# EAGLE design MEchaduino_03 (EAGLE 9.0.0)
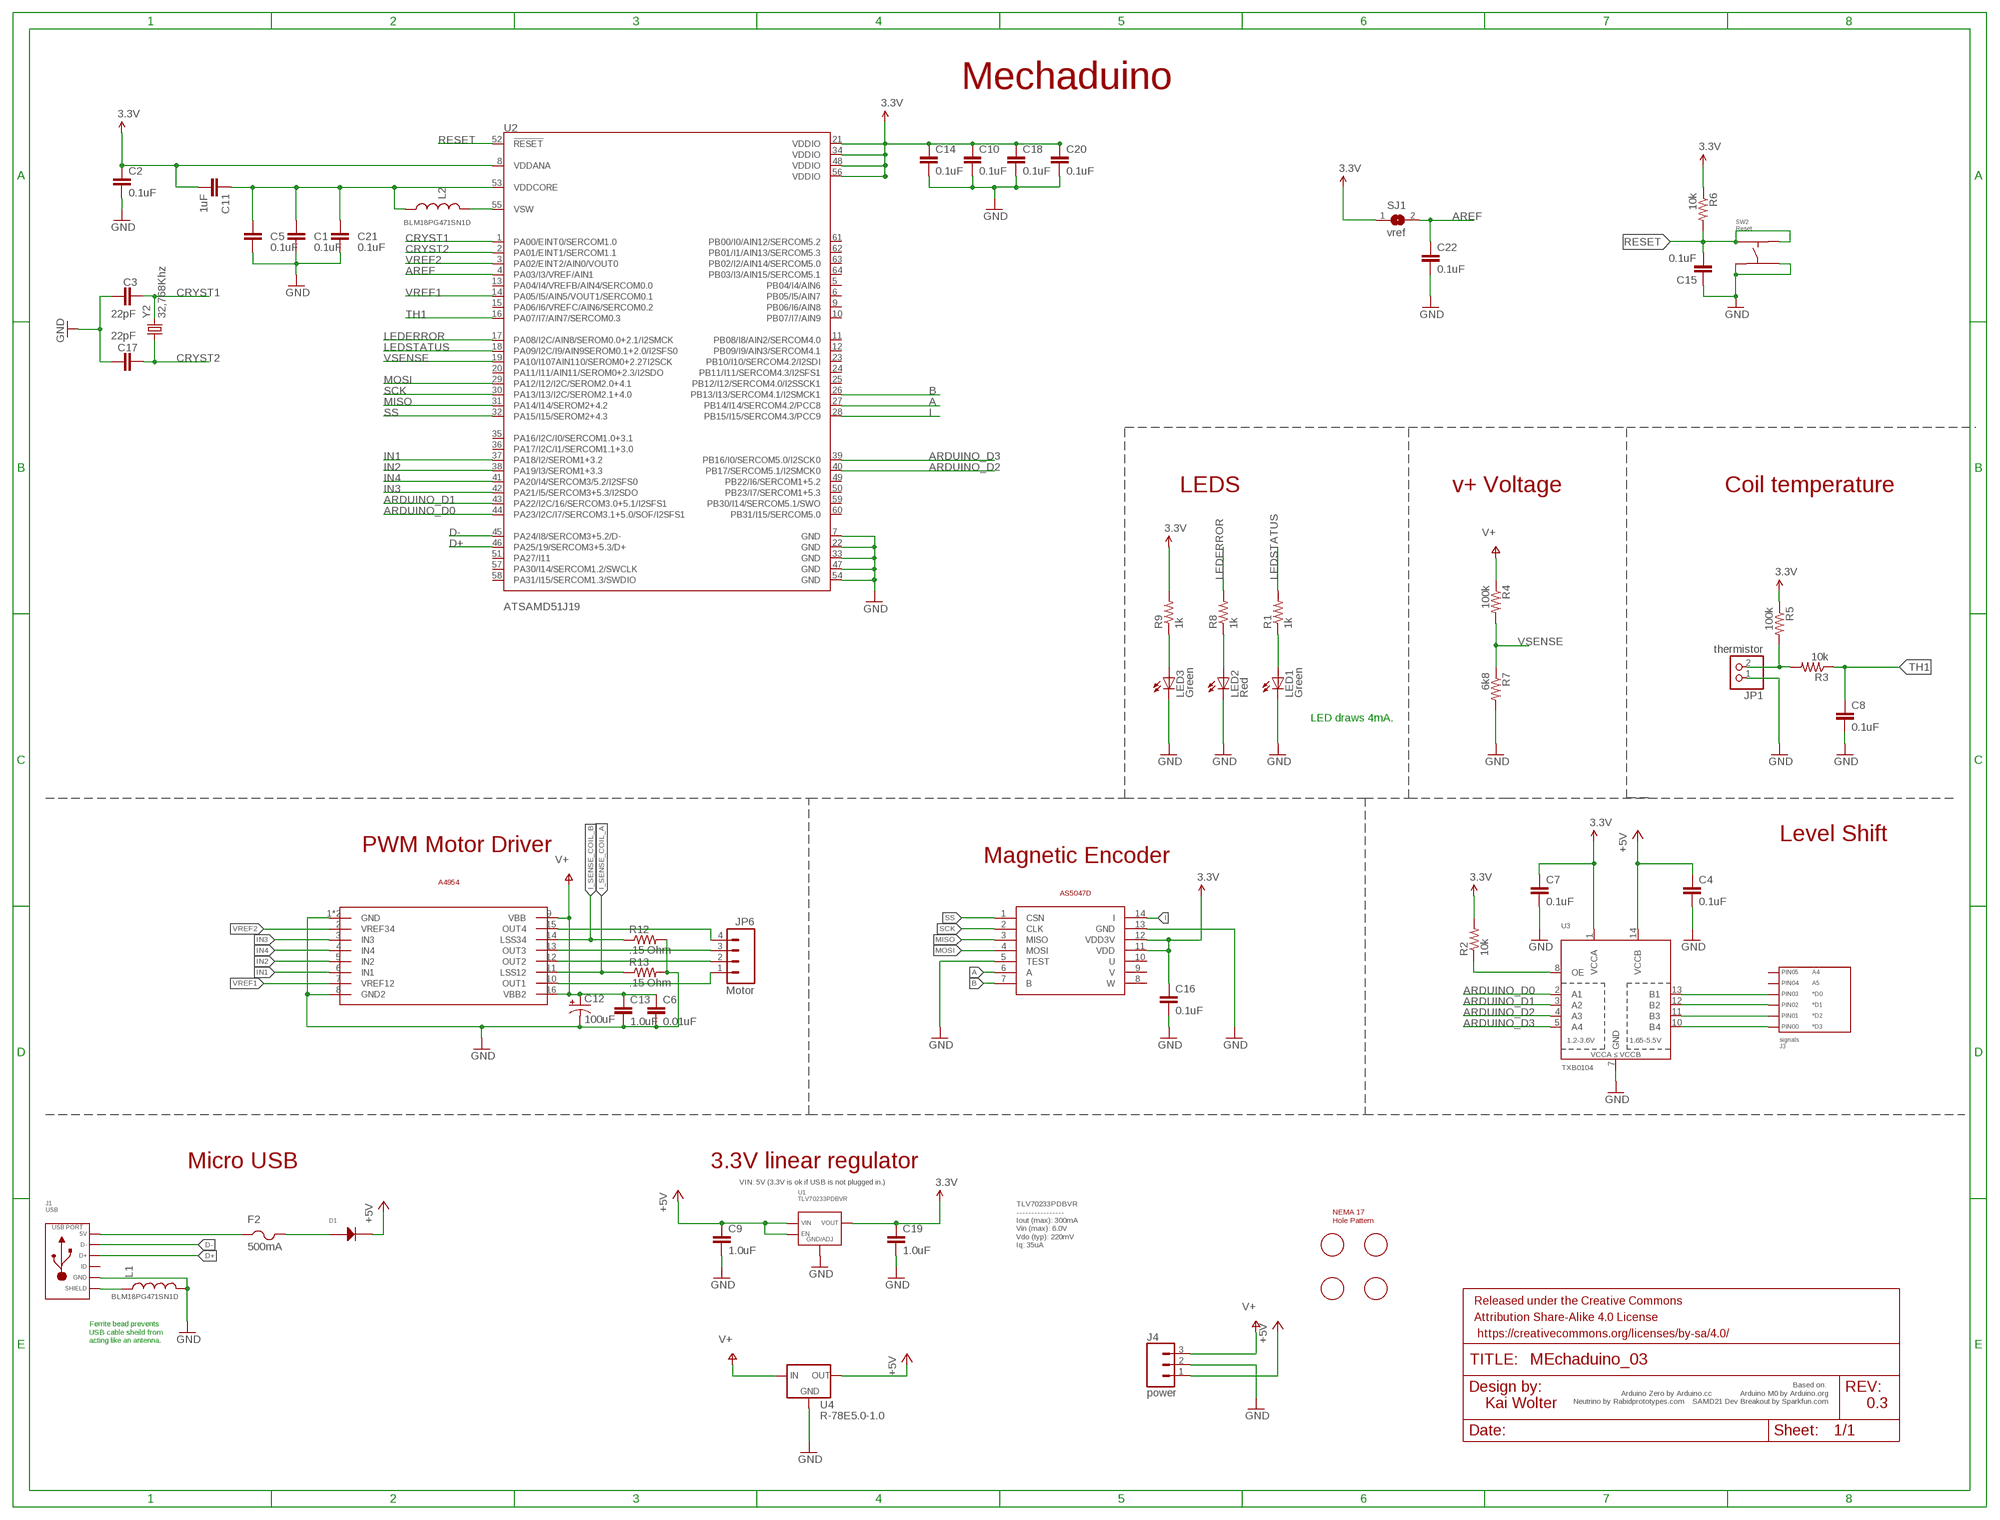
[diagram p0: schematic, sheet 1]

## Parts
C1  0.1uF  CAP0402  [0402-CAP]
C2  0.1uF  CAP0402  [0402-CAP]
C3  22pF  CAP0603  [0603-CAP]
C4  0.1uF  CAP0402  [0402-CAP]
C5  0.1uF  CAP0402  [0402-CAP]
C6  0.01uF  CAP0603  [0603-CAP]
C7  0.1uF  CAP0402  [0402-CAP]
C8  0.1uF  CAP0402  [0402-CAP]
C9  1.0uF  CAP0402  [0402-CAP]
C10  0.1uF  CAP0402  [0402-CAP]
C11  1uF  CAP0402  [0402-CAP]
C12  100uF  CAP_POLD  [PANASONIC_D]
C13  1.0uF  CAP0603  [0603-CAP]
C14  0.1uF  CAP0402  [0402-CAP]
C15  0.1uF  CAP0402  [0402-CAP]
C16  0.1uF  CAP0402  [0402-CAP]
C17  22pF  CAP0603  [0603-CAP]
C18  0.1uF  CAP0402  [0402-CAP]
C19  1.0uF  CAP0402  [0402-CAP]
C20  0.1uF  CAP0402  [0402-CAP]
C21  0.1uF  CAP0402  [0402-CAP]
C22  0.1uF  CAP0402  [0402-CAP]
D1  DIODE_SOD-123  [SOD-123]
F2  500mA  PTCFUSE-1206  [R1206]
FRAME1  FRAME-LEDGER  [CREATIVE_COMMONS]
J1  USB  USB_MICRO_RIGHT  [MICROUSB-RIGHT]
J3  signals  HEADER_01X06_PTH_2.54MM  [PTH_2.54MM_01X06]
J4  power  CONN_03  [1X03]
JP1  thermistor  PINHD-1X2  [1X02]
JP6  Motor  M04PTH  [1X04]
L1  BLM18PG471SN1D  INDUCTOR0603-TDK  [0603-TDK]
L2  BLM18PG471SN1D  INDUCTOR0603-TDK  [0603-TDK]
LED1  Green  0044_KPT-2012YC  [CHIPLED_0805]
LED2  Red  0044_KPT-2012YC  [CHIPLED_0805]
LED3  Green  0044_KPT-2012YC  [CHIPLED_0805]
R1  1k  R-US_R0402  [R0402]
R2  10k  R-US_R0402  [R0402]
R3  10k  R-US_R0402  [R0402]
R4  100k  R-US_R0402  [R0402]
R5  100k  R-US_R0402  [R0402]
R6  10k  R-US_R0402  [R0402]
R7  6k8  R-US_R0402  [R0402]
R8  1k  R-US_R0402  [R0402]
R9  1k  R-US_R0402  [R0402]
R12  .15 Ohm  R-US_R1206  [R1206]
R13  .15 Ohm  R-US_R1206  [R1206]
SJ1  vref  SJ  [SJ]
SW2  Reset  TACT_4.2MM  [TACT4.2MM]
U1  TLV70233PDBVR  [SOT-23-5]
U2  ATSAMD51J19  [TQFP64]
U3  TXB0104  TXB0104PWR  [TSSOP14]
U4  R-78E5.0-1.0  [DC-DC_CONVERTER_78XX]
U$1  AVAGO_DRIVERTHERM  [TSSOP16_THERM]
U$2  NEMA17_HOLE_PATTERNNEW  [NEMA17_HOLE_PATTERN_2]
U$4  AS5047D  [TSSOP14]
Y2  32,768Khz  CRYSTAL2012  [CRYSTAL-SMD-2.0X1.2]

## Nets
3.3V: C2.1 C7.1 C10.1 C11.2 C14.1 C16.1 C18.1 C19.1 C20.1 R2.2 R5.1 R6.1 R9.2 SJ1.1 U1.P$5(VOUT) U2.8(VDDANA) U2.21(VDDIO) U2.34(VDDIO) U2.48(VDDIO) U2.56(VDDIO) U3.1(VCCA) U$4.11(VDD) U$4.12(VDD3V)
+5V: C4.1 C9.1 D1.CATHODE J4.1 U1.P$1(VIN) U1.P$3(EN) U3.14(VCCB) U4.VOUT(OUT)
A: U2.27(PB14/I14/SERCOM4.2/PCC8) U$4.6(A)
ARDUINO_D0: U2.44(PA23/I2C/I7/SERCOM3.1+5.0/SOF/I2SFS1) U3.2(A1)
ARDUINO_D1: U2.43(PA22/I2C/16/SERCOM3.0+5.1/I2SFS1) U3.3(A2)
ARDUINO_D2: U2.40(PB17/SERCOM5.1/I2SMCK0) U3.4(A3)
ARDUINO_D3: U2.39(PB16/I0/SERCOM5.0/I2SCK0) U3.5(A4)
AREF: C22.1 SJ1.2 U2.4(PA03/I3/VREF/AIN1)
B: U2.26(PB13/I13/SERCOM4.1/I2SMCK1) U$4.7(B)
CRYST1: C3.2 U2.1(PA00/EINT0/SERCOM1.0) Y2.2
CRYST2: C17.2 U2.2(PA01/EINT1/SERCOM1.1) Y2.1
D+ [USBpair]: J1.3(D+) U2.46(PA25/19/SERCOM3+5.3/D+)
D- [USBpair]: J1.2(D-) U2.45(PA24/I8/SERCOM3+5.2/D-)
GND [gnd]: C1.2 C2.2 C3.1 C4.2 C5.2 C6.2 C7.2 C8.2 C9.2 C10.2 C12.- C13.2 C14.2 C15.1 C16.2 C17.1 C18.2 C19.2 C20.2 C21.2 C22.2 J1.5(GND) J4.2 JP1.1 L1.2 LED1.C LED2.C LED3.C R7.2 R12.2 R13.2 SW2.P$3 SW2.P$4 U1.P$2(GND/ADJ) U2.7(GND) U2.22(GND) U2.33(GND) U2.47(GND) U2.54(GND) U3.7(GND) U4.GND U$1.1(GND) U$1.8(GND2) U$1.P$1(GND) U$4.5(TEST) U$4.13(GND)
I: U2.28(PB15/I15/SERCOM4.3/PCC9) U$4.14(I)
I_SENSE_COIL_A: R13.1 U$1.11(LSS12)
I_SENSE_COIL_B: R12.1 U$1.14(LSS34)
IN1: U2.37(PA18/I2/SEROM1+3.2) U$1.6(IN1)
IN2: U2.38(PA19/I3/SEROM1+3.3) U$1.5(IN2)
IN3: U2.42(PA21/I5/SERCOM3+5.3/I2SDO) U$1.3(IN3)
IN4: U2.41(PA20/I4/SERCOM3/5.2/I2SFS0) U$1.4(IN4)
LEDERROR: R8.2 U2.17(PA08/I2C/AIN8/SEROM0.0+2.1/I2SMCK)
LEDSTATUS: R1.2 U2.18(PA09/I2C/I9/AIN9SEROM0.1+2.0/I2SFS0)
MISO: U2.31(PA14/I14/SEROM2+4.2) U$4.3(MISO)
MOSI: U2.29(PA12/I12/I2C/SEROM2.0+4.1) U$4.4(MOSI)
N$1: LED1.A R1.1
N$2: J3.P$4(PIN3) U3.13(B1)
N$3: LED2.A R8.1
N$4: J3.P$3(PIN2) U3.12(B2)
N$5: J3.P$2(PIN1) U3.11(B3)
N$6: R2.1 U3.8(OE)
N$7: J3.P$1(PIN0) U3.10(B4)
N$8: C1.1 C5.1 C11.1 C21.1 L2.1 U2.53(VDDCORE)
N$9: J1.S1(SLD) J1.S2(SLD) J1.S3(SLD) J1.S4(SLD) J1.S5(SLD) J1.S6(SLD) J1.S7(SLD) J1.S8(SLD) L1.1
N$10: L2.2 U2.55(VSW)
N$11: LED3.A R9.1
N$12: D1.ANODE F2.2
N$13: JP6.4 U$1.15(OUT4)
N$14: JP6.1 U$1.10(OUT1)
N$15: JP6.2 U$1.12(OUT2)
N$16: JP6.3 U$1.13(OUT3)
N$23: JP1.2 R3.2 R5.2
N$36 [usbvcc]: F2.1 J1.1(5V)
RESET: C15.2 R6.2 SW2.P$1 SW2.P$2 U2.52(!RESET!)
SCK: U2.30(PA13/I13/I2C/SEROM2.1+4.0) U$4.2(CLK)
SS: U2.32(PA15/I15/SEROM2+4.3) U$4.1(CSN)
TH1: C8.1 R3.1 U2.16(PA07/I7/AIN7/SERCOM0.3)
V+: C6.1 C12.+ C13.1 J4.3 R4.1 U4.VIN(IN) U$1.9(VBB) U$1.16(VBB2)
VREF1: U2.14(PA05/I5/AIN5/VOUT1/SERCOM0.1) U$1.7(VREF12)
VREF2: U2.3(PA02/EINT2/AIN0/VOUT0) U$1.2(VREF34)
VSENSE: R4.2 R7.1 U2.19(PA10/I107AIN110/SEROM0+2.27I2SCK)
Unconnected: J1.4(ID) J3.P$5(PIN4) J3.P$6(PIN5) U2.5(PB04/I4/AIN6) U2.6(PB05/I5/AIN7) U2.9(PB06/I6/AIN8) U2.10(PB07/I7/AIN9) U2.11(PB08/I8/AIN2/SERCOM4.0) U2.12(PB09/I9/AIN3/SERCOM4.1) U2.13(PA04/I4/VREFB/AIN4/SERCOM0.0) U2.15(PA06/I6/VREFC/AIN6/SERCOM0.2) U2.20(PA11/I11/AIN11/SEROM0+2.3/I2SDO) U2.23(PB10/I10/SERCOM4.2/I2SDI) U2.24(PB11/I11/SERCOM4.3/I2SFS1) U2.25(PB12/I12/SERCOM4.0/I2SSCK1) U2.35(PA16/I2C/I0/SERCOM1.0+3.1) U2.36(PA17/I2C/I1/SERCOM1.1+3.0) U2.49(PB22/I6/SERCOM1+5.2) U2.50(PB23/I7/SERCOM1+5.3) U2.51(PA27/I11) U2.57(PA30/I14/SERCOM1.2/SWCLK) U2.58(PA31/I15/SERCOM1.3/SWDIO) U2.59(PB30/I14/SERCOM5.1/SWO) U2.60(PB31/I15/SERCOM5.0) U2.61(PB00/I0/AIN12/SERCOM5.2) U2.62(PB01/I1/AIN13/SERCOM5.3) U2.63(PB02/I2/AIN14/SERCOM5.0) U2.64(PB03/I3/AIN15/SERCOM5.1) U$4.8(W) U$4.9(V) U$4.10(U)

## Notes on the sheet
- Mechaduino
- LEDS | v+ Voltage | Coil temperature
- LED draws 4mA.
- Level Shift
- PWM Motor Driver
- Magnetic Encoder
- A4954
- Micro USB | 3.3V linear regulator
- VIN: 5V (3.3V is ok if USB is not plugged in.)
- TLV70233PDBVR
  ----------------
  Iout (max): 300mA 
  Vin (max): 6.0V
  Vdo (typ): 220mV
  Iq: 35uA
- Ferrite bead prevents 
  USB cable sheild from 
  acting like an antenna.
- Based on: 
  Arduino Zero by Arduino.cc              Arduino M0 by Arduino.org
  Neutrino by Rabidprototypes.com    SAMD21 Dev Breakout by Sparkfun.com
- Kai Wolter | 0.3

## Library data of the parts
C1-C11 C13-C22 = swift:CAP: Capacitor Standard 0603 ceramic capacitor, and 0.1" leaded capacitor.
C12 = SparkFun-Capacitors:CAP_POL: Capacitor Polarized These are standard SMD and PTH capacitors. Normally 10uF, 47uF, and 100uF in electrolytic and tantalum varieties. Always verify the external diameter of the through hole cap, it varies with capacity, voltage, and manufacturer. The EIA devices should be standard.
D1 = MF_Discrete_Semiconductor:DIODE: Library: MF_Discrete_Semiconductor Description: Device for Single Packaged Diodes. Manufacture part number (MFG#) can be added via Attributes.; MFG#: N/A
F2 = adafruit:PTCFUSE: PTC fuses, resettable thermistors
FRAME1 = SparkFun-Aesthetics:FRAME-LEDGER: Schematic Frame - Ledger Standard 11x14 US Ledger frame
J1 = MF_Connectors:USB: Library: MF_Connectors Description: 5 Pin USB Connectors. SLD is the shield connection. Usually tied to ground through a small ferrite bead.
J3 = MF_Connectors:HEADER_01X06: Library: MF_Connectors Description: Header Connector with 6 Positions and 01 Rows. Use the LABEL Attribute to label the pin on the schematic and PCB. You can remove the attributes on the PCB by using the SMASH function on the part and then deleting the text.; LABEL00: *D3; LABEL01: *D2; LABEL02: *D1; LABEL03: *D0; LABEL04: A5; LABEL05: A4
J4 = SparkFun-Connectors:CONN_03: Multi connection point. Often used as Generic Header-pin footprint for 0.1 inch spaced/style header connections On any of the 0.1 inch spaced packages, you can populate with these: Break Away Headers - Straight <https://www.sparkfun.com/products/116> (PRT-00116) Break Away Male Headers - Right Angle <https://www.sparkfun.com/products/553> (PRT-00553) Female Headers <https://www.sparkfun.com/products/115> (PRT-00115) Break Away Headers - Machine Pin <https://www.sparkfun.com/products/117> (PRT-00117) Break Away Female Headers - Swiss Machine Pin <https://www.sparkfun.com/products/743> (PRT-00743) Stackable Header - 3 Pin (Female, 0.1") <https://www.sparkfun.com/products/13875> (PRT-13875) For SCREWTERMINALS and SPRING TERMINALS visit here: Screw Terimnals on SparkFun.com <https://www.sparkfun.com/search/results?term=Screw+Terminals> (5mm/3.5mm/2.54mm spacing) This device is also useful as a general connection point to wire up your design to another part of your project. Our various solder wires solder well into these plated through hole pads. Hook-Up Wire - Assortment (Stranded, 22 AWG) <https://www.sparkfun.com/products/11375> (PRT-11375) Hook-Up Wire - Assortment (Solid Core, 22 AWG) <https://www.sparkfun.com/products/11367> (PRT-11367) View the entire wire category on our website here <https://www.sparkfun.com/categories/141> Special notes: Molex polarized connector foot print use with SKU : PRT-08232 with associated crimp pins and housings.
JP1 = pinhead:PINHD-1X2: PIN HEADER
JP6 = SparkFun-Connectors:M04: Header 4 Standard 4-pin 0.1" header. Use with straight break away headers (SKU : PRT-00116), right angle break away headers (PRT-00553), swiss pins (PRT-00743), machine pins (PRT-00117), and female headers (PRT-00115). Molex polarized connector foot print use with SKU : PRT-08231 with associated crimp pins and housings. 1MM SMD Version SKU: PRT-10208
L1 L2 = SparkFun-Passives:INDUCTOR: Inductors Basic Inductor/Choke - 0603 and 1206. Footprints are not proven and vary greatly between part numbers. SRN6045- 33uH, 20% 1.4A SDR0403-560KL - 56uH, 10%, 500mA RMS/740mA peak
LED1-LED3 = Opto:0044_KPT-2012YC: LED YELLOW - SMD - 0805; MONTHLY_USAGE: _____; PART_NUMBER: KPT-2012YC; PRICE: _____; SUPPLIER: _____; TYPE: Opto; VALUE: Yellow
R1-R9 = rcl:R-US_: RESISTOR, American symbol; SPICEPREFIX: R
R12 R13 = adafruit:R-US_: RESISTOR, American symbol
SJ1 = jumper:SJ: SMD solder JUMPER
SW2 = MF_Switches:TACT: Library: MF_Switches Description: Device for Tact Switches. Manufacture part number (MFG#) can be added via Attributes.
U1 = MF_IC_Power:TLV702: Manufacturer Part #: TLV702 Manufacturer: Texas Instruments Description: LDO Voltage Regulators
U2 = atsamd51:ATSAMD51J19: Atmel SAMD21G SMART ARM-Based Microcontroller The Atmel ® | SMART ™ SAM D21 is a series of low-power microcontrollers using the 32-bit ARM ® Cortex ® -M0+ processor, and ranging from 32- to 64-pins with up to 256KB Flash and 32KB of SRAM. The SAM D21 devices operate at a maximum frequency of 48MHz and reach 2.46 CoreMark/MHz. They are designed for simple and intuitive migration with identical peripheral modules, hex compatible code, identical linear address map and pin compatible migration paths between all devices in the product series. All devices include intelligent and flexible peripherals, Atmel Event System for inter-peripheral signaling, and support for capacitive touch button, slider and wheel user interfaces. Datasheet <http://ww1.microchip.com/downloads/en/DeviceDoc/SAM-D5xE5x-Family-Datasheet-01507B.pdf>
U3 = SparkFun-IC-Comms:TXB0104PWR: 4-Bit Bi-Directional Level Shifter 1.2V-3.6V (VCCA) to 1.65V-5.5V (VCCB) bi-directional level shifter with auto direction sensing. Max data rate - VCCA 1.8V: 20Mbps (50ns), VCCA 3.3V: 100Mbps (10ns) Digikey: 296-21929-1-ND (TSSOP) Datasheet <http://cdn.sparkfun.com/datasheets/BreakoutBoards/txb0104.pdf> SparkFun Products SparkFun Cellular Shield - MG2639 <https://www.sparkfun.com/products/13120> (CEL-13120) SparkFun Level Shifting microSD Breakout <https://www.sparkfun.com/products/13743> (DEV-13743) SparkFun Voltage-Level Translator Breakout - TXB0104 <https://www.sparkfun.com/products/11771> (BOB-11771) SparkFun Block for Intel® Edison - UART <https://www.sparkfun.com/products/13040> (DEV-13040) SparkFun Block for Intel® Edison - Arduino <https://www.sparkfun.com/products/13036> (DEV-13036); PROD_ID: NA-XXXXX
U4 = SparkFun-IC-Power:R-78E5.0-1.0: Recom Power 5V 1A DC/DC Converter The Recom R-78E5.0-X.X is a compact DC/DC converter module that is a pin for pin drop-in replacement for the LM7805 linear voltage regulator. Specifications: Input Range: 7-28V Output Voltage: 5V Output Current: 1A Max Efficiency: 91% Datasheet <https://www.recom-power.com/pdf/Innoline/R-78Exx-1.0.pdf>; PROD_ID: COM-13655
U$1 = avagopack:AVAGO_DRIVER
U$2 = stepper_servo_prototype_1:NEMA17_HOLE_PATTERN
U$4 = stepper_servo_prototype_1:AS5047D
Y2 = SparkFun-FreqCtrl:CRYSTAL: Various standard crystals. Proven footprints. Spark Fun Electronics SKU : COM-00534

## Net classes
2 gnd: width 0.152 mm, drill 0.305 mm, clearance 0.152 mm
3 usbvcc: width 0.152 mm, drill 0.305 mm, clearance 0.152 mm
4 USBpair: width 0.152 mm, drill 0.305 mm, clearance 0.152 mm

## Board
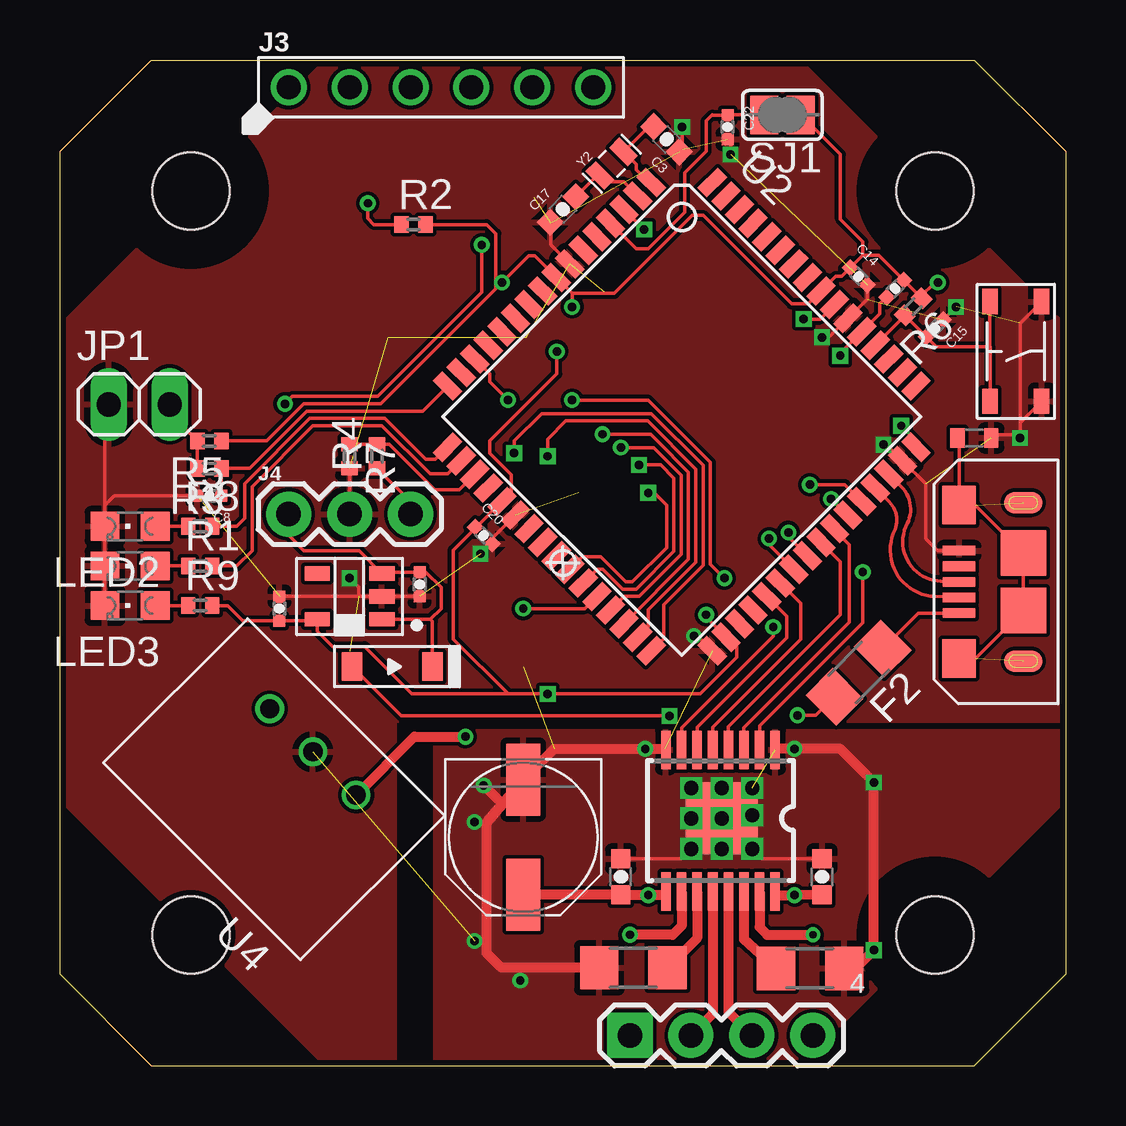
[diagram p1: board, top side]
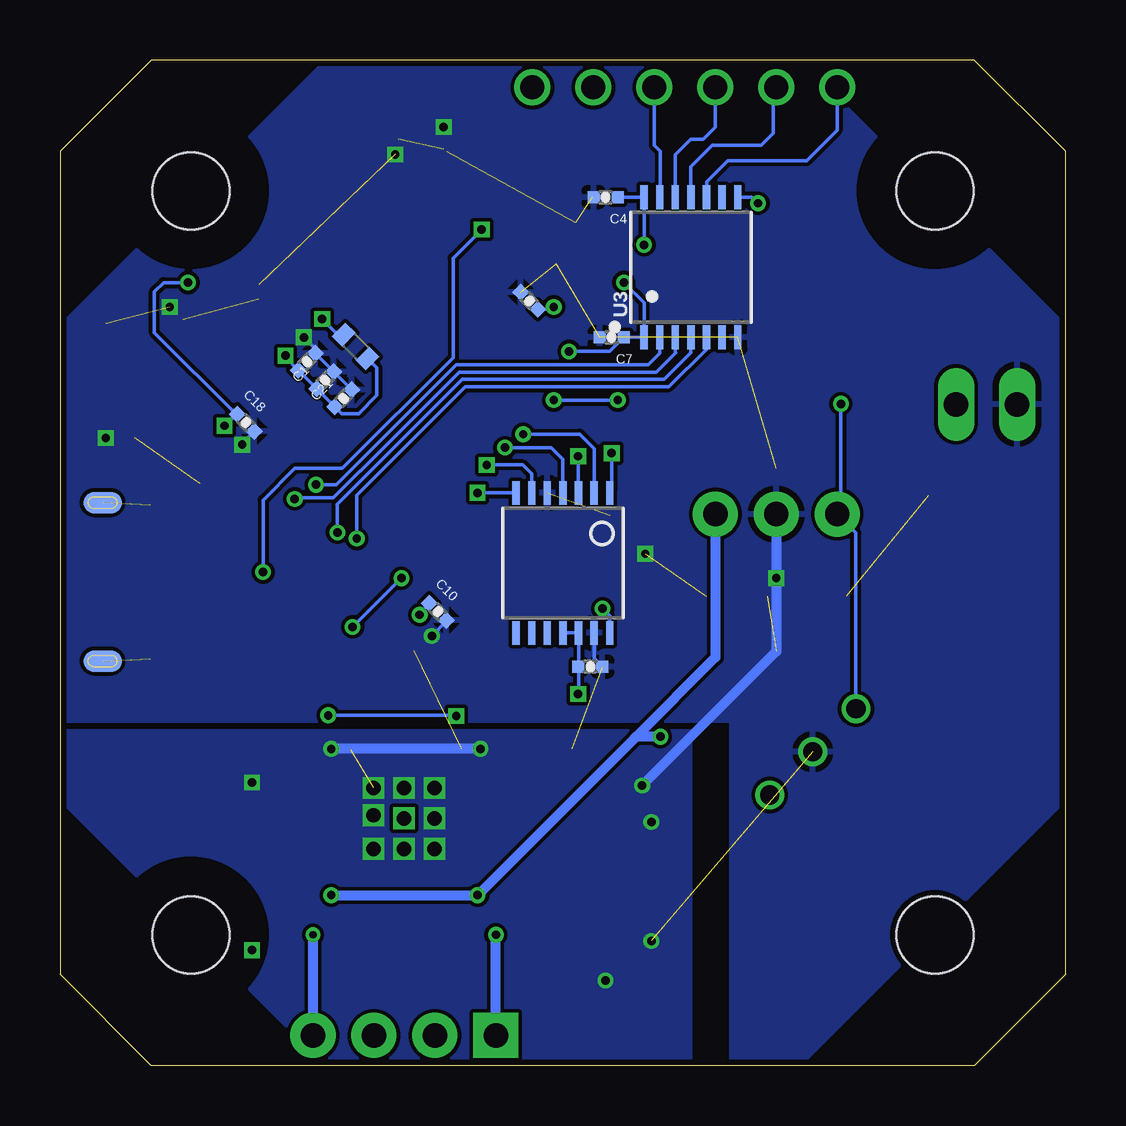
[diagram p2: board, bottom side, seen from below]

Size 41.91 x 41.91 mm. Coordinates in mm from the lower left corner, seen from the top.
Outline: 3.81,0 38.1,0 41.91,3.81 41.91,38.1 38.1,41.91 3.81,41.91 0,38.1 0,3.81 3.81,0
Copper layers (1*16): Top 0.035mm / dielectric 0.2mm / Bottom 0.035mm
Design rules "MacroFabDRU *": minimum track width 6mil, minimum drill 12mil, track to track 6mil, track to pad 6mil, pad to pad 6mil, via to via 6mil, smd to smd 0mil, copper to edge 10mil, drill to drill 10mil, minimum pad ring 6mil, minimum via ring 6mil, stop-mask expansion 2mil, vias tented up to drill 25mil, thermal gap 10mil

### Footprints (pad centres in the part's own frame; a part is rotated, then mirrored left to right if it is on the bottom)
0402-CAP = smd 0.5 x 0.5: 1 -0.5,0; 2 0.5,0
0603-CAP = smd 0.8 x 0.8: 1 -0.75,0; 2 0.75,0
PANASONIC_D = smd 3 x 1.4: + 2.4,0; - -2.4,0
SOD-123 = smd 0.85 x 1.2: ANODE 1.675,0; CATHODE -1.675,0
R1206 = smd 1.6 x 1.803: 1 -1.422,0; 2 1.422,0
MICROUSB-RIGHT = smd 0.4 x 1.35: 1 -1.3,1.27; 2 -0.65,1.27; 3 0,1.27; 4 0.65,1.27; 5 1.3,1.27 | smd 0.9 x 1.6: S1 -3.3,-1.4; S2 3.3,-1.4 | smd 1.6 x 1.4: S3 -3.2,1.27; S4 3.2,1.27 | smd 1.9 x 1.9: S5 -1.2,-1.405; S6 1.2,-1.405 | smd 0.9 x 1.6 bottom: S7 -3.3,-1.4; S8 3.3,-1.4
PTH_2.54MM_01X06 = drill 1: P$1 -6.35,0; P$2 -3.81,0; P$3 -1.27,0; P$4 1.27,0; P$5 3.81,0; P$6 6.35,0
1X03 = drill 1.016 pad 1.88: 1 0,0; 2 2.54,0; 3 5.08,0
1X02 = drill 1.016 long: 1 -1.27,0; 2 1.27,0
1X04 = drill 1.016 pad 1.88 square: 1 0,0 | drill 1.016 pad 1.88: 2 2.54,0; 3 5.08,0; 4 7.62,0
0603-TDK = smd 0.6 x 0.8: 1 -0.7,0; 2 0.7,0
CHIPLED_0805 = smd 1.2 x 1.2: A 0,-1.05; C 0,1.05
R0402 = smd 0.6 x 0.7: 1 -0.5,0; 2 0.5,0
SJ = smd 1.168 x 1.6: 1 -0.762,0; 2 0.762,0
TACT4.2MM = smd 1.05 x 0.65: P$1 -2.075,1.075; P$2 2.075,1.075; P$3 -2.075,-1.075; P$4 2.075,-1.075
SOT-23-5 = smd 1.05 x 0.6: P$1 -1.35,0.95; P$2 -1.35,0; P$3 -1.35,-0.95; P$4 1.35,-0.95; P$5 1.35,0.95
TQFP64 = smd 1.194 x 0.559: 1 -7.8,6; 2 -7.8,5.2; 3 -7.8,4.4; 4 -7.8,3.6; 5 -7.8,2.8; 6 -7.8,2; 7 -7.8,1.2; 8 -7.8,0.4; 9 -7.8,-0.4; 10 -7.8,-1.2; 11 -7.8,-2; 12 -7.8,-2.8; 13 -7.8,-3.6; 14 -7.8,-4.4; 15 -7.8,-5.2; 16 -7.8,-6; 33 7.8,-6; 34 7.8,-5.2; 35 7.8,-4.4; 36 7.8,-3.6; 37 7.8,-2.8; 38 7.8,-2; 39 7.8,-1.2; 40 7.8,-0.4; 41 7.8,0.4; 42 7.8,1.2; 43 7.8,2; 44 7.8,2.8; 45 7.8,3.6; 46 7.8,4.4; 47 7.8,5.2; 48 7.8,6 | smd 0.559 x 1.194: 17 -6,-7.8; 18 -5.2,-7.8; 19 -4.4,-7.8; 20 -3.6,-7.8; 21 -2.8,-7.8; 22 -2,-7.8; 23 -1.2,-7.8; 24 -0.4,-7.8; 25 0.4,-7.8; 26 1.2,-7.8; 27 2,-7.8; 28 2.8,-7.8; 29 3.6,-7.8; 30 4.4,-7.8; 31 5.2,-7.8; 32 6,-7.8; 49 6,7.8; 50 5.2,7.8; 51 4.4,7.8; 52 3.6,7.8; 53 2.8,7.8; 54 2,7.8; 55 1.2,7.8; 56 0.4,7.8; 57 -0.4,7.8; 58 -1.2,7.8; 59 -2,7.8; 60 -2.8,7.8; 61 -3.6,7.8; 62 -4.4,7.8; 63 -5.2,7.8; 64 -6,7.8
TSSOP14 = smd 0.305 x 0.991: 1 -1.95,-2.918; 2 -1.3,-2.918; 3 -0.65,-2.918; 4 0,-2.918; 5 0.65,-2.918; 6 1.3,-2.918; 7 1.95,-2.918; 8 1.95,2.918; 9 1.3,2.918; 10 0.65,2.918; 11 0,2.918; 12 -0.65,2.918; 13 -1.3,2.918; 14 -1.95,2.918
DC-DC_CONVERTER_78XX = drill 0.8: GND 0,0; VIN -2.54,0; VOUT 2.54,0
TSSOP16_THERM = smd 0.4 x 1.6: 1 -2.225,-2.85; 2 -1.575,-2.85; 3 -0.925,-2.85; 4 -0.275,-2.85; 5 0.375,-2.85; 6 1.025,-2.85; 7 1.675,-2.85; 8 2.325,-2.85; 9 2.325,3.05; 10 1.675,3.05; 11 1.025,3.05; 12 0.375,3.05; 13 -0.275,3.05; 14 -0.925,3.05; 15 -1.575,3.05; 16 -2.225,3.05 | smd 3 x 3: P$1 0,0
NEMA17_HOLE_PATTERN_2 = hole 3.2: -15.5,15.5; -15.5,-15.5; 15.5,-15.5; 15.5,15.5
CRYSTAL-SMD-2.0X1.2 = smd 0.6 x 1.1: 1 -0.7,0; 2 0.7,0

### Placement (x,y rotation side)
C1  30.86,28.57 45 bottom
C2  22.35,31.88 135 bottom
C3  25.27,38.61 135 top
C4  19.18,36.2 180 bottom
C5  31.62,29.34 45 bottom
C6  31.75,7.87 90 top
C7  18.92,30.35 180 bottom
C8  6.22,23.75 180 top
C9  14.99,20.07 270 top
C10  26.16,18.92 315 bottom
C11  34.8,32.38 45 top
C12  19.3,9.53 270 top
C13  23.37,7.87 90 top
C14  33.27,32.89 315 top
C15  36.45,30.73 225 top
C16  19.81,16.64 0 bottom
C17  20.95,35.69 45 top
C18  34.16,26.8 315 bottom
C19  9.14,19.05 90 top
C20  17.65,22.1 315 top
C21  30.1,27.81 45 bottom
C22  27.81,39.12 270 top
D1  13.84,16.64 180 top
F2  33.27,16.38 225 top
FRAME1  0.61,-10.16 0 top  (outside the outline)
J1  38.73,20.17 90 top
J3  15.88,40.77 0 top
J4  9.53,22.99 0 top
JP1  3.3,27.56 0 top
JP6  23.75,1.27 0 top
L1  38.1,26.16 0 top
L2  29.59,29.97 135 bottom
LED1  2.92,20.83 90 top
LED2  2.92,22.48 90 top
LED3  2.92,19.18 90 top
R1  5.84,20.83 0 top
R2  14.73,35.05 0 top
R3  6.22,24.89 180 top
R4  13.21,25.4 90 top
R5  6.22,26.04 180 top
R6  35.56,31.62 225 top
R7  12.06,25.4 270 top
R8  5.84,22.48 0 top
R9  5.84,19.18 0 top
R12  31.25,4.06 0 top
R13  23.89,4.09 180 top
SJ1  30.1,39.62 180 top
SW2  39.83,29.77 90 top
U1  12.06,19.56 180 top
U2  25.91,27.05 315 top
U3  15.62,33.27 0 bottom
U4  10.54,13.08 135 top
U$1  27.57,10.31 180 top
U$2  20.95,20.95 0 top
U$4  20.95,20.95 180 bottom
Y2  22.99,37.59 45 top

### Tracks (layer width: path | path; a pad name or v marks a point on that pad's centre or on a via)
3.3V  (via drill 0.35)
  Top 0.152: R9.2 6.99,19.18 7.62,18.54 C19.1 10.66,18.55 U1.P$5 10.71,18.11 11.36,17.47 12.69,17.47 14.66,15.49 18.67,15.49 | 17.35,22.45 C20.1 17.12,22.45 | 17.35,22.45 U2.21 18.8,23.9 18.8,24.64 17.91,25.53 17.91,26.04 20.7,28.83 v20.7,29.77 | U2.48 35.67,26.06 v35.05,26.67 | SJ1.1 32.51,37.97 32.51,35.28 33.46,34.34 33.46,33.78 | R5.1 8.61,26.04 10.16,27.58 13.36,27.58 18.16,32.38 | 21.34,32.19 23.09,32.19 26.34,35.43 26.8,35.43 30.48,31.75 31.17,31.75 U2.56 32.32,32.89 32.57,32.89 C14.1 33.46,33.78 | 35.85,32.04 C11.2 34.11,33.78 33.46,33.78 | 35.85,32.04 R6.1 | 18.67,15.49 v20.32,15.49 26.67,15.49 28.19,17.02 28.19,17.47 27.81,17.86 U2.34 26.92,18.68 | v36.58,32.64 36.45,32.64 35.85,32.04 | 26.92,18.68 v26.92,18.8 | 26.92,18.67 26.92,18.68 | 18.16,32.38 v18.41,32.64 19.52,33.75 19.78,33.75 U2.8 21.34,32.19 | 21.34,32.19 v21.34,31.62 | 18.67,15.49 16.38,17.78 16.38,21.49 17.35,22.45 | R2.2 17.78,35.05 18.16,34.67 18.16,32.38
  Bottom 0.152: v35.05,26.67 34.57,27.15 | 34.57,27.15 C18.1 | C16.1 U$4.12 U$4.11 | C16.1 | v20.32,15.49 20.3,15.51 C16.1 | 34.57,27.15 37.97,30.55 37.97,32.26 37.59,32.64 v36.58,32.64 | v20.7,29.77 19.01,29.77 C7.1 U3.1 17.57,31.8 v18.41,32.64 | v26.92,18.8 26.92,18.87 C10.1 | v21.34,31.62 21.44,31.52 C2.1
+5V  (via drill 0.35)
  Top 0.152: 15.43,18.61 15.88,19.05 15.88,19.94 15.25,20.57 C9.1 13.47,20.57 U1.P$3 12.46,21.46 10.16,21.46 9.53,22.1 J4.1 | 15.43,18.61 U1.P$1 | D1.CATHODE 15.52,18.52 15.43,18.61 | v9.37,27.58 9.68,27.89 13.23,27.89 17.57,32.23 v17.57,34.21
  Bottom 0.152: C4.1 U3.14 v17.57,34.21 | v9.37,27.58 9.37,23.14 J4.1 8.74,22.21 U4.VOUT
A  (via drill 0.35)
  Top 0.152: v24.13,25.04 25.03,25.04 25.58,24.49 25.58,21.44 24,19.86 23.44,19.86 22.61,20.7 22.39,20.7 U2.27
  Bottom 0.152: v24.13,25.04 22.63,25.04 22.25,24.67 U$4.6
ARDUINO_D0  (via drill 0.35)
  Top 0.152: U2.44 32.7,24.22 v31.24,24.22
  Bottom 0.152: U3.2 16.92,29.69 17.4,29.21 25.4,29.21 30.39,24.22 v31.24,24.22
ARDUINO_D1  (via drill 0.35)
  Top 0.152: v32.13,23.62 32.8,22.95 U2.43
  Bottom 0.152: U3.3 16.27,29.73 16.26,29.72 17.07,28.91 25.27,28.91 29.38,24.8 29.41,24.77 30.52,23.66 32.09,23.66 v32.13,23.62
ARDUINO_D2  (via drill 0.35)
  Top 0.152: U2.40 30.35,22.04 v30.35,22.23
  Bottom 0.152: U3.4 15.62,29.72 16.74,28.6 25.15,28.6 30.35,23.39 v30.35,22.23
ARDUINO_D3  (via drill 0.35)
  Top 0.152: U2.39 29.55,21.72 v29.55,21.97
  Bottom 0.152: U3.5 14.97,29.86 16.54,28.3 25.02,28.3 29.55,23.77 v29.55,21.97
AREF
  Top 0.152: SJ1.2 27.82,39.62 C22.1 27.19,39.62 27.18,39.62 26.92,39.37 26.92,38.1 26.04,37.21 26.04,35.56 24.51,34.04 24.01,34.04 U2.4
B  (via drill 0.35)
  Top 0.152: v24.51,23.88 24.77,23.88 25.27,23.37 25.27,21.59 23.85,20.17 23.57,20.17 22.53,21.21 21.76,21.21 U2.26
  Bottom 0.152: v24.51,23.88 U$4.7
CRYST1
  Top 0.152: C3.2 24.53,39.14 Y2.2 24,37.57 24,37.34 24.53,36.81 U2.1
CRYST2
  Top 0.152: C17.2 22.36,37.1 Y2.1 22.76,36.83 23.48,36.83 U2.2
D+
  Top 0.152: U2.46 35.05,24.13 arc-71 35.31,22.61 arc116 36.7,20.19 J1.3
D-
  Top 0.152: U2.45 34.54,23.5 arc-66 34.8,22.35 arc114 36.45,19.56 J1.2
GND  (via drill 0.35, 0.6)  (19 unrouted)
  Top 0.152: 29.84,13.21 U$1.1 | R12.2 32.69,4.12 32.99,4.12 33.13,4.04 | LED3.C LED1.C LED2.C 1.87,23.37 | C9.2 13.42,19.57 U1.P$2 12.45,19.56 | 12.45,19.56 9.15,19.56 C19.2 | 12.45,19.56 12.45,19.94 v12.06,20.32 | R7.2 J4.2 | U2.22 18.01,21.98 C20.2 17.6,21.34 v17.53,21.34 | v34.31,25.88 34.43,25.88 U2.47 36.07,24.25 36.07,21.97 36.58,21.46 36.58,21.47 J1.5 | C14.2 33.63,31.94 U2.54 32.04,30.35 v31.75,30.35 | C15.1 v37.34,31.62 | SW2.P$4 40.01,30.95 40.01,26.8 | 40.01,26.8 40.01,26.29 | 40.01,26.29 v40.01,26.16 | SW2.P$3 40.01,26.8 | 40.01,26.8 | L1.2 38.93,26.29 40.01,26.29 | C17.1 20.45,35.13 20.45,34.21 U2.7 | C22.2 27.94,38.49 v27.94,37.97 | C3.1 25.92,38.2 v25.92,39.12 | U2.33 26.57,17.91 v26.42,17.91 | 1.87,23.37 1.87,27.4 JP1.1 | 1.87,23.37 2.25,23.75 C8.2 | 25.2,13.21 U$1.8 | 17.78,5.21 v17.27,5.21 | 17.78,10.15 17.29,10.15 v17.27,10.16 | 19.18,4.09 v19.18,3.56 | 18.42,10.92 18.44,10.92 | U$1.P$1 v27.57,9.04 | U$1.P$1 v28.84,9.04 | U$1.P$1 28.71,10.31 v28.84,10.44 | U$1.P$1 v28.84,11.58 | U$1.P$1 v27.57,11.58 | U$1.P$1 v26.3,11.58 | U$1.P$1 v26.3,10.31 | U$1.P$1 v26.3,9.04 | U$1.P$1 25.88,8.62 C13.2 | U$1.P$1 29.26,8.62 C6.2
  Top 0.406: 29.84,13.21 v30.61,13.21 32.51,13.21 v33.91,11.81 v33.91,4.82 33.13,4.04 | 25.2,13.21 v24.38,13.21 20.59,13.21 C12.- 18.44,10.92 17.78,10.15 17.78,5.21 17.78,4.7 18.39,4.09 19.18,4.09 R13.2 | v17.65,11.68 18.42,10.92
  Bottom 0.152: 19.74,36.2 C4.2 19.68,36.31 | v34.31,25.88 34.31,25.94 C18.2 | U$4.13 19.66,16.98 C16.2 | v31.75,30.35 31.27,29.87 C5.2 C1.2 C21.2 | v26.42,17.91 25.81,18.52 C10.2
  Bottom 0.406: v24.38,13.21 v30.61,13.21 | J4.2 12.06,17.27 v17.65,11.68
  pour Bottom: 15.62,0 15.62,13.97 41.91,13.97 41.91,0
  pour Top: 15.62,0 15.62,13.97 41.91,13.97 41.91,0
  pour Bottom: 13.84,0 0,0 0,41.91 41.91,41.91 41.91,14.35 13.97,14.35 13.97,0.13
  pour Top: 13.84,0 0,0 0,41.91 41.91,41.91 41.91,14.35 13.97,14.35 13.97,0.13
GND1  (via drill 0.6)
  other vias: 27.57,10.31
I  (via drill 0.35)
  Top 0.152: v19.3,19.05 21.87,19.05 U2.28
  Bottom 0.152: U$4.14 19,18.75 v19.3,19.05
I_SENSE_COIL_A
  Top 0.406: U$1.11 26.55,5.33 R13.1
I_SENSE_COIL_B
  Top 0.406: U$1.14 28.5,5.27 R12.1
IN1
  Top 0.152: U$1.6 26.55,14.1 30.27,17.83 30.27,18.73 U2.37
IN2
  Top 0.152: U$1.5 27.2,14.12 30.86,17.78 30.86,19.27 U2.38
IN3
  Top 0.152: U2.42 32.34,22.31 32.34,22.27 32.89,21.72 32.89,18.49 28.5,14.1 U$1.3
IN4
  Top 0.152: U2.41 32.51,21.01 32.51,18.8 32.13,18.41 27.85,14.13 U$1.4 27.85,13.88
LEDERROR
  Top 0.152: R8.2 7.37,22.48 7.7,22.81 7.7,24.26 10.41,26.98 13.54,26.98 15.24,25.27 15.64,25.27 U2.17
LEDSTATUS
  Top 0.152: R1.2 7.37,20.83 8,21.46 8,24.13 10.54,26.67 13.41,26.67 15.42,24.66 16.17,24.66 U2.18
MISO  (via drill 0.35)
  Top 0.152: v20.32,25.4 20.32,26.11 21.08,26.87 24.48,26.87 26.49,24.87 26.49,20.98 24.51,19 24.51,18.3 U2.31
  Bottom 0.152: v20.32,25.4 20.32,23.89 U$4.3
MOSI  (via drill 0.35)
  Top 0.152: v23.37,25.76 24.73,25.76 25.15,25.34 25.88,24.61 25.88,21.31 24.13,19.56 23.5,19.56 23.5,19.55 U2.29
  Bottom 0.152: v23.37,25.76 21.44,25.76 20.95,25.27 U$4.4
N$1
  Top 0.152: LED1.A R1.1
N$2
  Bottom 0.152: U3.13 16.89,36.22 16.89,38.1 17.14,38.35 J3.P$4
N$3
  Top 0.152: LED2.A R8.1
N$4
  Bottom 0.152: J3.P$3 14.61,39.12 15.11,38.61 15.62,38.61 16.27,37.96 U3.12
N$5
  Bottom 0.152: J3.P$2 12.19,40.64 12.19,38.86 12.7,38.35 14.73,38.35 15.62,37.47 U3.11
N$6  (via drill 0.35)
  Top 0.152: R2.1 13.08,35.05 12.83,35.31 v12.83,35.94
  Bottom 0.152: v12.83,35.94 13.08,36.2 13.08,36.19 U3.8
N$7
  Bottom 0.152: J3.P$1 9.53,38.99 10.79,37.72 14.1,37.72 14.97,36.84 U3.10
N$8  (via drill 0.35)
  Top 0.152: v32.51,29.59 32.51,29.7 U2.53 34.16,31.35 34.16,31.75 C11.1
  Bottom 0.152: v32.51,29.59 32.51,29.52 C5.1 C1.1 C21.1 30.17,27.18 29.46,27.18 28.7,27.94 28.7,29.08 L2.1
N$9  (4 unrouted)
  Top 0.152: L1.1 37.47,26.1 J1.S4 38.14,23.37 J1.S6 J1.S5 38.14,16.97 J1.S3
N$10  (via drill 0.35)
  Top 0.152: v30.99,31.12 31.67,31.12 U2.55
  Bottom 0.152: L2.2 30.34,30.47 v30.99,31.12
N$11
  Top 0.152: LED3.A R9.1
N$12  (via drill 0.35)
  Top 0.152: v25.4,14.58 14.23,14.58 D1.ANODE | F2.2 31.5,14.61 v30.73,14.61
  Bottom 0.152: v30.73,14.61 25.43,14.61 v25.4,14.58
N$13  (via drill 0.3)
  Top 0.152: JP6.4 31.37,1.4
  Top 0.406: U$1.15 29.15,5.78 29.46,5.46 v31.37,5.46
  Bottom 0.406: v31.37,5.46 JP6.4
N$14  (via drill 0.35)
  Top 0.152: U$1.10
  Top 0.406: U$1.10 25.9,5.83 25.53,5.46 v23.75,5.46
  Bottom 0.406: JP6.1 v23.75,5.46
N$15
  Top 0.406: U$1.12 27.2,2.18 JP6.2
N$16
  Top 0.152: 27.81,7.23 U$1.13
  Top 0.406: U$1.13 27.85,2.25 JP6.3
N$23
  Top 0.152: R3.2 R5.2 4.57,27.19 JP1.2
N$36
  Top 0.152: F2.1 35.76,18.87 J1.1
RESET
  Top 0.152: U2.52 35.21,31.26 R6.2 C15.2 36.5,29.97 38.73,29.97 | 38.73,29.97 38.73,31.83 SW2.P$2 | SW2.P$1 38.75,29.95 38.73,29.97
SCK  (via drill 0.35)
  Top 0.152: U2.30 26.19,21.11 26.19,24.74 24.89,26.04 24.61,26.32 v22.61,26.32
  Bottom 0.152: U$4.2 19.66,25.71 20.26,26.32 v22.61,26.32
SS  (via drill 0.35)
  Top 0.152: v18.92,25.53 18.92,26.04 20.07,27.18 24.64,27.18 26.8,25.02 26.8,20.86 25.15,19.2 25.15,17.8 U2.32
  Bottom 0.152: v18.92,25.53 18.92,23.95 U$4.1
TH1
  Top 0.152: C8.1 R3.1 7.9,24.89 10.29,27.28 15.11,27.28 U2.16
V+  (via drill 0.35)
  Top 0.152: U$1.16 29.95,7.11 | U$1.9 25.1,7.11 | R4.1 14.61,23.5 J4.3 | C13.1 | C12.+
  Top 0.406: 29.95,7.11 v30.61,7.11 C6.1 | 25.1,7.11 v24.51,7.11 C13.1 | C13.1 C12.+ | U4.VIN 14.77,13.72 v16.89,13.72
  Bottom 0.152: 17.91,13.72 17.97,13.65
  Bottom 0.406: v30.61,7.11 v24.51,7.11 17.97,13.65 14.61,17.02 J4.3 | v16.89,13.72 17.91,13.72
VREF1  (via drill 0.35)
  Top 0.152: U$1.7 25.9,14.09 29.72,17.91 v29.72,18.29 | U2.14 | v21.34,27.74 24.51,27.74 27.1,25.14 27.1,20.9 v27.69,20.32 | v18.67,27.74 17.91,28.5 17.91,28.83 U2.14
  Top 0.254: U$1.7 25.91,13.17
  Bottom 0.152: v21.34,27.74 v18.67,27.74 | v29.72,18.29 v27.69,20.32
VREF2  (via drill 0.35)
  Top 0.152: U$1.2 29.15,14.16 33.45,18.46 v33.45,20.57 | v24.34,34.84 | v24.34,34.84 U2.3
  Bottom 0.152: v24.34,34.84 25.53,33.66 25.53,29.51 30.15,24.89 32.13,24.89 33.45,23.57 v33.45,20.57
VSENSE
  Top 0.152: R7.1 R4.2 13.72,25.9 15.62,24 16.64,24 U2.19

### Text on the board
tPlace: 4
Reference: Joe Church